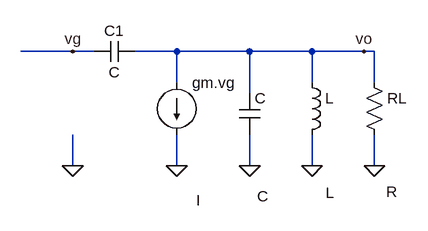
[diagram p0: schematic Draft5.asc]
Draft5.asc, the LTspice schematic file:
Version 4
SHEET 1 880 680
WIRE -80 96 -160 96
WIRE -48 96 -80 96
WIRE 80 96 16 96
WIRE 192 96 80 96
WIRE 288 96 192 96
WIRE 368 96 288 96
WIRE 384 96 368 96
WIRE 80 144 80 96
WIRE 288 144 288 96
WIRE 384 144 384 96
WIRE 192 160 192 96
WIRE -80 272 -80 224
WIRE 80 272 80 224
WIRE 192 272 192 224
WIRE 288 272 288 224
WIRE 384 272 384 224
FLAG 384 272 0
FLAG 288 272 0
FLAG 192 272 0
FLAG 80 272 0
FLAG -80 272 0
FLAG -80 96 vg
FLAG 368 96 vo
SYMBOL current 80 144 R0
WINDOW 3 30 181 Left 2
SYMATTR InstName gm.vg
SYMBOL cap 176 160 R0
WINDOW 3 28 159 Left 2
SYMATTR InstName C
SYMBOL ind 272 128 R0
WINDOW 3 37 185 Left 2
SYMATTR InstName L
SYMBOL res 368 128 R0
WINDOW 3 34 184 Left 2
SYMATTR InstName RL
SYMBOL cap 16 80 R90
WINDOW 0 0 32 VBottom 2
WINDOW 3 32 32 VTop 2
SYMATTR InstName C1

The netlist it stands for:
* Draft5.asc
I§gm.vg vo 0 I
C vo 0 C
L vo 0 L
RL vo 0 R
C1 vo vg C
.backanno
.end